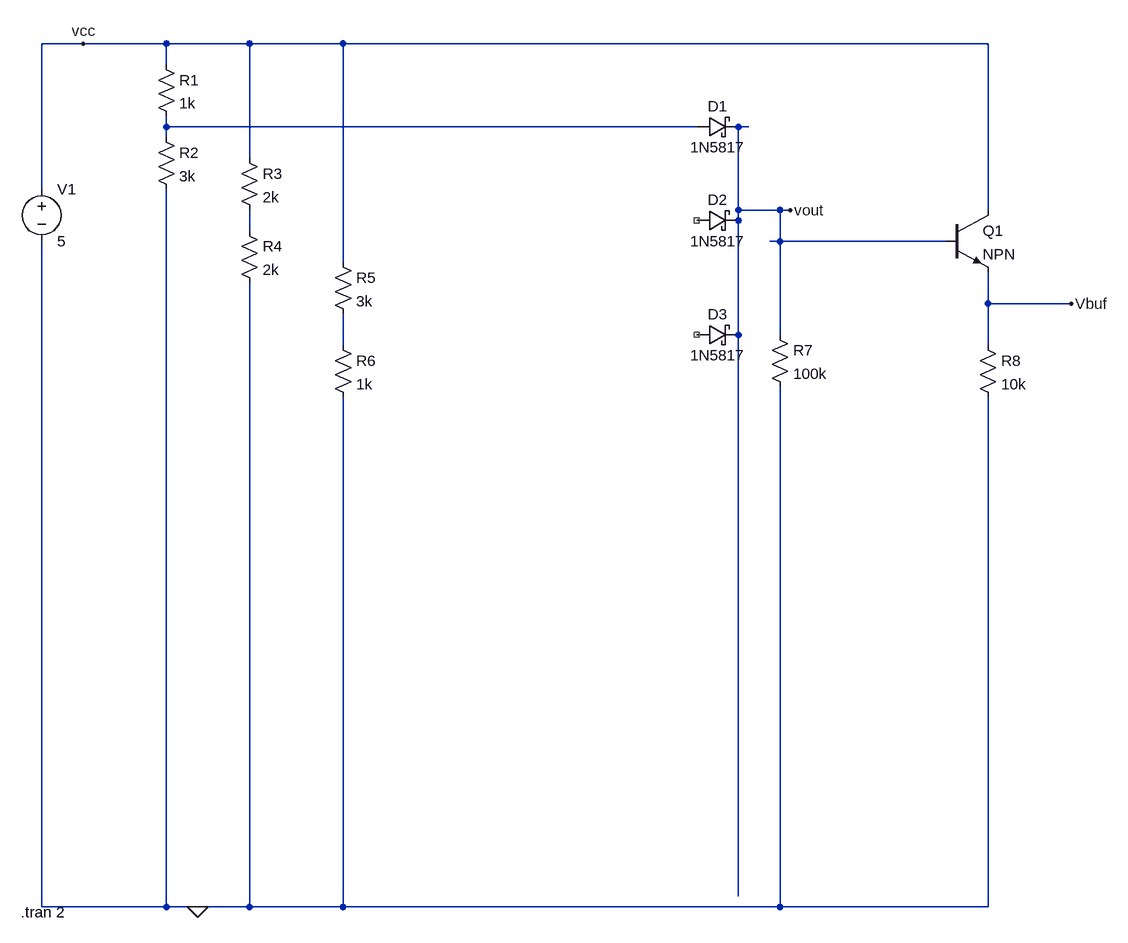
[diagram p0: schematic fully-passive.asc]
fully-passive.asc, the LTspice schematic file:
Version 4
SHEET 1 1664 1224
WIRE 64 -128 0 -128
WIRE 192 -128 64 -128
WIRE 320 -128 192 -128
WIRE 464 -128 320 -128
WIRE 1456 -128 464 -128
WIRE 192 -96 192 -128
WIRE 192 0 192 -16
WIRE 1008 0 192 0
WIRE 1088 0 1072 0
WIRE 192 16 192 0
WIRE 320 48 320 -128
WIRE 0 96 0 -128
WIRE 1072 128 1072 0
WIRE 1136 128 1072 128
WIRE 1152 128 1136 128
WIRE 1456 128 1456 -128
WIRE 1072 144 1072 128
WIRE 320 160 320 128
WIRE 1136 176 1136 128
WIRE 1136 176 1120 176
WIRE 1392 176 1136 176
WIRE 464 208 464 -128
WIRE 1456 272 1456 224
WIRE 1584 272 1456 272
WIRE 1072 320 1072 144
WIRE 1136 320 1136 176
WIRE 464 336 464 288
WIRE 1456 336 1456 272
WIRE 1072 1184 1072 320
WIRE 0 1200 0 176
WIRE 192 1200 192 96
WIRE 192 1200 0 1200
WIRE 240 1200 192 1200
WIRE 320 1200 320 240
WIRE 320 1200 240 1200
WIRE 464 1200 464 416
WIRE 464 1200 320 1200
WIRE 1136 1200 1136 400
WIRE 1136 1200 464 1200
WIRE 1456 1200 1456 416
WIRE 1456 1200 1136 1200
FLAG 64 -128 vcc
FLAG 1152 128 vout
FLAG 240 1200 0
FLAG 1584 272 Vbuf
SYMBOL voltage 0 80 R0
WINDOW 123 0 0 Left 2
WINDOW 39 0 0 Left 2
SYMATTR InstName V1
SYMATTR Value 5
SYMBOL res 176 -112 R0
SYMATTR InstName R1
SYMATTR Value 1k
SYMBOL res 176 0 R0
SYMATTR InstName R2
SYMATTR Value 3k
SYMBOL res 304 32 R0
SYMATTR InstName R3
SYMATTR Value 2k
SYMBOL res 304 144 R0
SYMATTR InstName R4
SYMATTR Value 2k
SYMBOL res 448 192 R0
SYMATTR InstName R5
SYMATTR Value 3k
SYMBOL res 448 320 R0
SYMATTR InstName R6
SYMATTR Value 1k
SYMBOL schottky 1008 16 R270
WINDOW 0 32 32 VTop 2
WINDOW 3 0 32 VBottom 2
SYMATTR InstName D1
SYMATTR Value 1N5817
SYMATTR Description Diode
SYMATTR Type diode
SYMBOL schottky 1008 160 R270
WINDOW 0 32 32 VTop 2
WINDOW 3 0 32 VBottom 2
SYMATTR InstName D2
SYMATTR Value 1N5817
SYMATTR Description Diode
SYMATTR Type diode
SYMBOL schottky 1008 336 R270
WINDOW 0 32 32 VTop 2
WINDOW 3 0 32 VBottom 2
SYMATTR InstName D3
SYMATTR Value 1N5817
SYMATTR Description Diode
SYMATTR Type diode
SYMBOL res 1120 304 R0
SYMATTR InstName R7
SYMATTR Value 100k
SYMBOL npn 1392 128 R0
SYMATTR InstName Q1
SYMBOL res 1440 320 R0
SYMATTR InstName R8
SYMATTR Value 10k
TEXT -32 1208 Left 2 !.tran 2

The netlist it stands for:
* fully-passive.asc
V1 vcc 0 5
R1 vcc N001 1k
R2 N001 0 3k
R3 vcc N002 2k
R4 N002 0 2k
R5 vcc N003 3k
R6 N003 0 1k
D1 N001 vout 1N5817
D2 NC_01 vout 1N5817
D3 NC_02 vout 1N5817
R7 vout 0 100k
Q1 vcc vout Vbuf 0 NPN
R8 Vbuf 0 10k
.model D D
.lib standard.dio
.model NPN NPN
.model PNP PNP
.lib standard.bjt
.tran 2
.backanno
.end